# EAGLE schematic mini_shutter_driver_schematic (EAGLE 9.7.0)
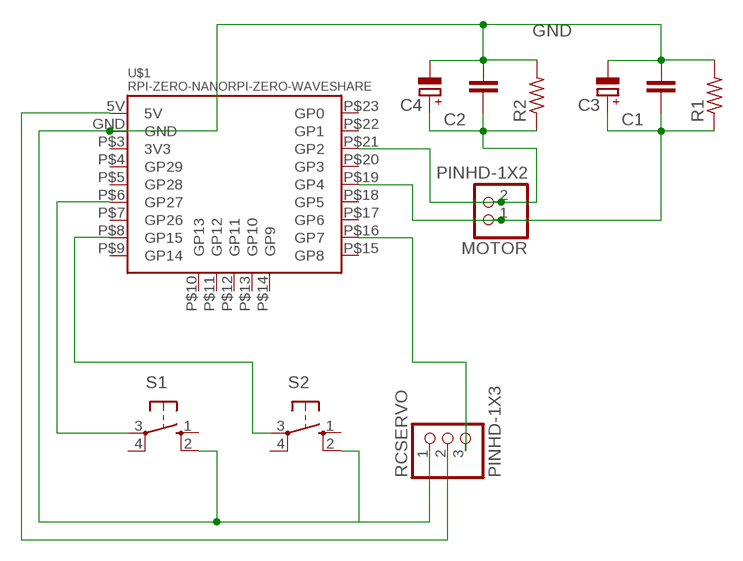
[diagram p0: schematic, sheet 1]

## Parts
C1  C_CHIP-0805(2012-METRIC)  [CAPC2012X110]
C2  C_CHIP-0805(2012-METRIC)  [CAPC2012X110]
C3  C-POL_TANTALUM-1206(3216-METRIC)  [CAPMP3216X180N]
C4  C-POL_TANTALUM-1206(3216-METRIC)  [CAPMP3216X180N]
MOTOR  PINHD-1X2  [1X02]
R1  R-US_CHIP-0805(2012-METRIC)  [RESC2012X65]
R2  R-US_CHIP-0805(2012-METRIC)  [RESC2012X65]
RCSERVO  PINHD-1X3  [1X03]
S1  10-XX  [B3F-10XX]
S2  10-XX  [B3F-10XX]
U$1  RPI-ZERO-NANORPI-ZERO-WAVESHARE  [RPI-ZERO-NANO-WAVESHARE]

## Nets
5V: RCSERVO.2 U$1.5V
GND: C1.2 C2.2 C3.2(-) C4.2(-) R1.2 R2.2 RCSERVO.1 S1.2(S1) S2.2(S1) U$1.GND
GP2: C2.1 C4.1(+) MOTOR.2 R2.1 U$1.P$21(GP2)
N$1: RCSERVO.3 U$1.P$16(GP7)
N$2: S1.3(P) U$1.P$6(GP27)
N$3: S2.3(P) U$1.P$8(GP15)
N$6: C1.1 C3.1(+) MOTOR.1 R1.1 U$1.P$19(GP4)
Unconnected: S1.1(S) S1.4(P1) S2.1(S) S2.4(P1) U$1.P$3(3V3) U$1.P$4(GP29) U$1.P$5(GP28) U$1.P$7(GP26) U$1.P$9(GP14) U$1.P$10(GP13) U$1.P$11(GP12) U$1.P$12(GP11) U$1.P$13(GP10) U$1.P$14(GP9) U$1.P$15(GP8) U$1.P$17(GP6) U$1.P$18(GP5) U$1.P$20(GP3) U$1.P$22(GP1) U$1.P$23(GP0)

## Library data of the parts
C1 C2 = Capacitor:C: Capacitor - Generic; CATEGORY: Capacitor
C3 C4 = Capacitor:C-POL: Capacitor Polarised - Generic; CATEGORY: Capacitor
MOTOR = Connector:PINHD-1X2: PIN HEADER; CATEGORY: CONNECTOR; SUB-CATEGORY: PIN-HEADER
R1 R2 = Tutorial - Fusion 360:R-US: Resistor Fixed - ANSI; CATEGORY: Resistor; SUB-CATEGORY: Fixed
RCSERVO = Connector:PINHD-1X3: PIN HEADER; CATEGORY: CONNECTOR; SUB-CATEGORY: PIN-HEADER
S1 S2 = switch-omron:10-XX: OMRON SWITCH; MPN: B3F-1000; OC_FARNELL: 176432; OC_NEWARK: 36M3542
U$1 = RPI-Zero:RPI-ZERO-NANO